# EAGLE design finalboard (EAGLE 9.6.2)
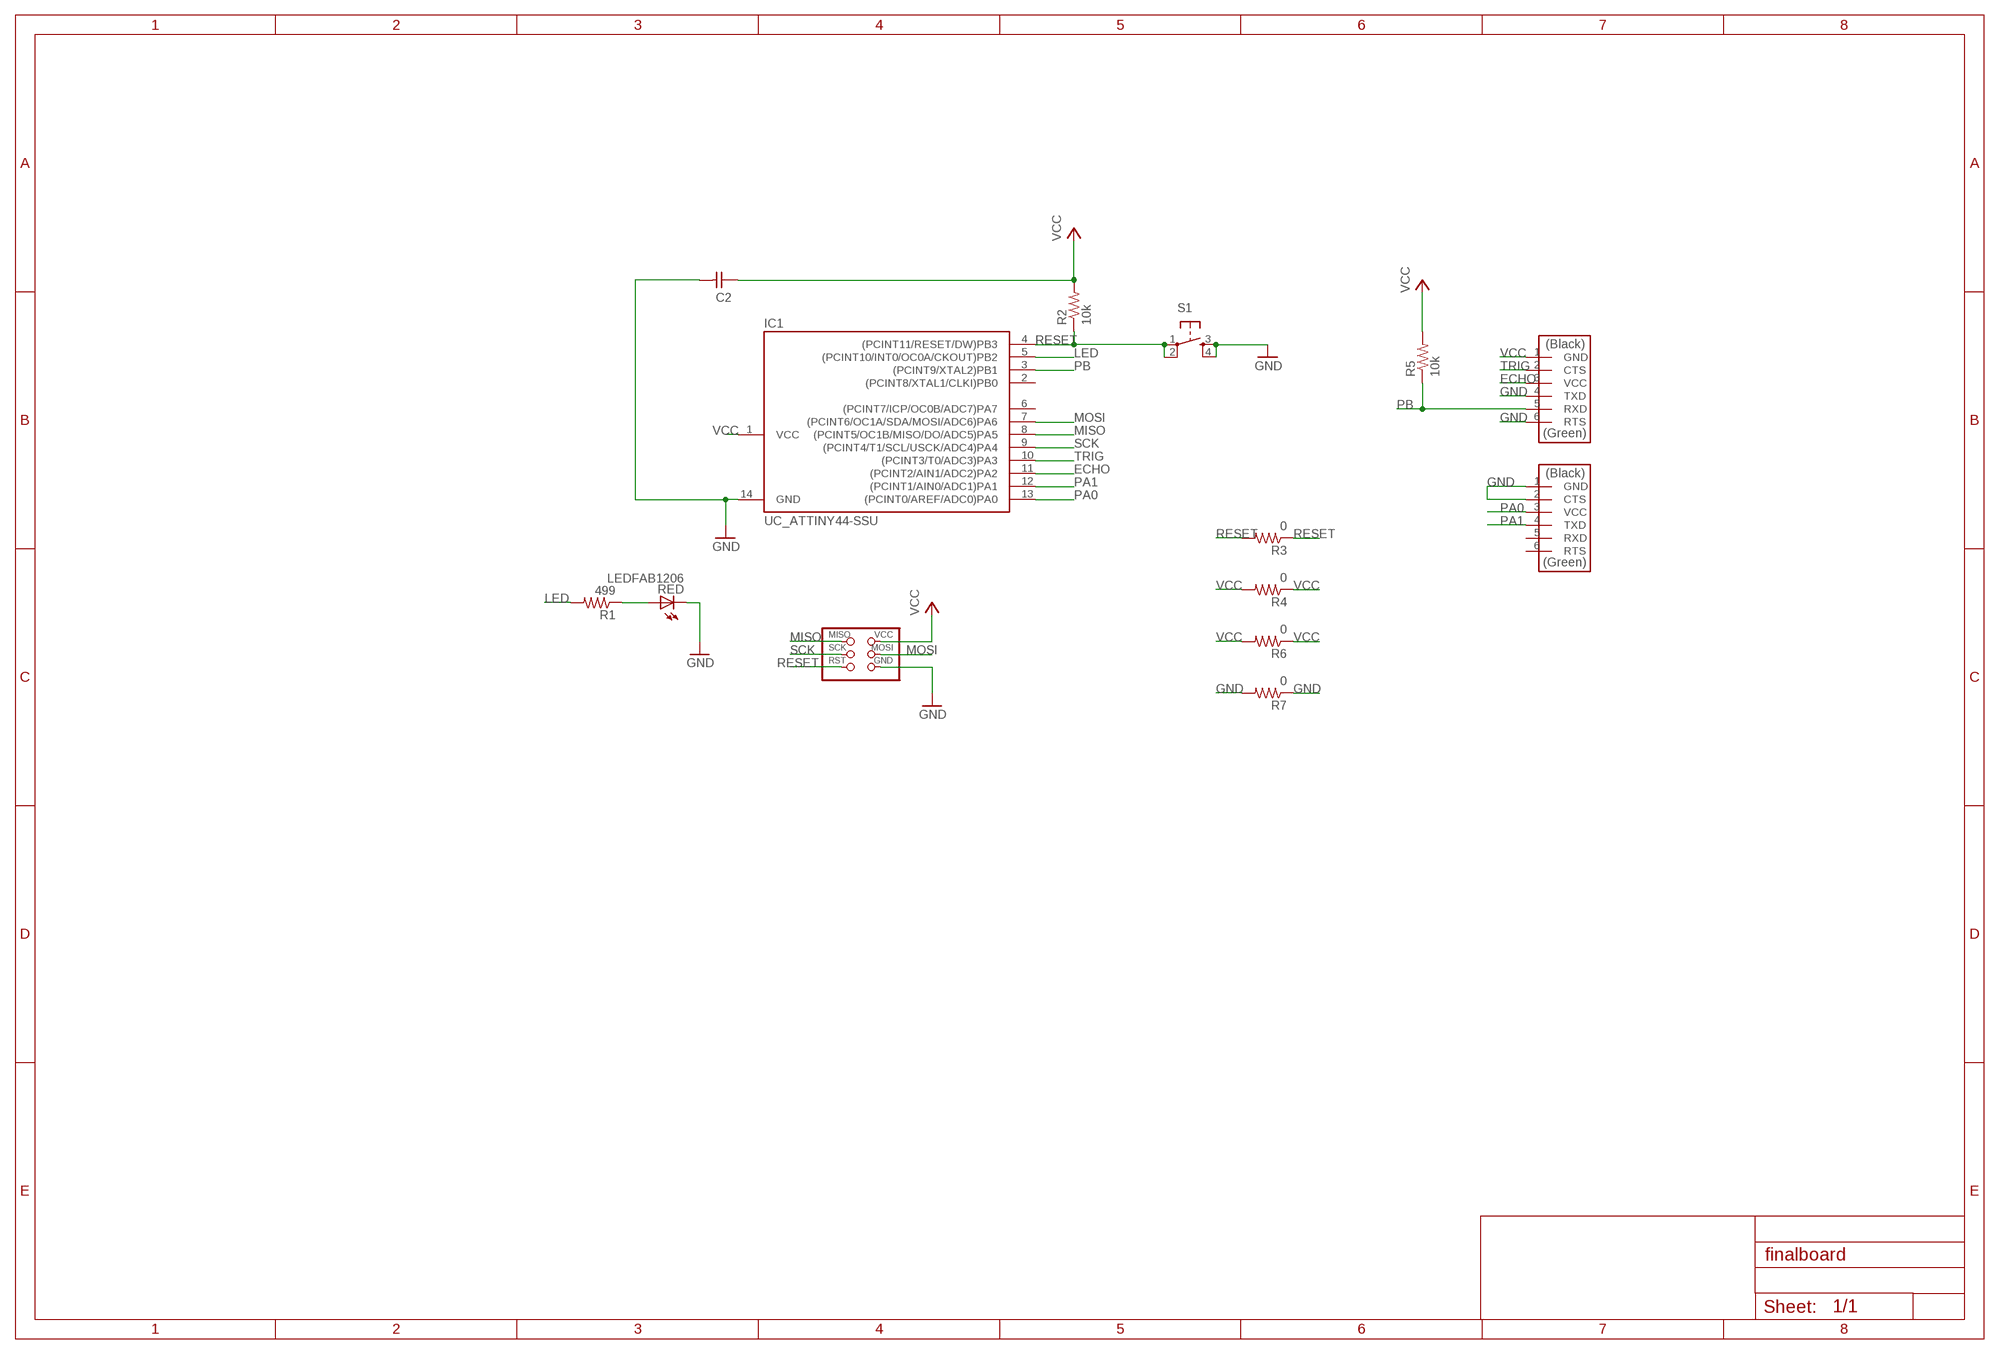
[diagram p0: schematic, sheet 1]

## Parts
C2  1u  CAP_UNPOLARIZEDFAB  [C1206FAB]
IC1  UC_ATTINY44-SSU  [SOIC14]
MOTOR  CONN_06_FTDI-SMD-HEADER  [1X06SMD]
R1  499  R1206FAB  [R1206FAB]
R2  10k  R1206FAB  [R1206FAB]
R3  0  R1206FAB  [R1206FAB]
R4  0  R1206FAB  [R1206FAB]
R5  10k  R1206FAB  [R1206FAB]
R6  0  R1206FAB  [R1206FAB]
R7  0  R1206FAB  [R1206FAB]
RED  LEDFAB1206  [LED1206FAB]
S1  SW_SWITCH_TACTILE_6MM6MM_SWITCH  [6MM_SWITCH]
U$3  CONN_03X2_AVRISPSMD  [2X03SMD]
ULTRANPB  CONN_06_FTDI-SMD-HEADER  [1X06SMD]

## Nets
ECHO: IC1.11((PCINT2/AIN1/ADC2)PA2) ULTRANPB.3(VCC)
GND: C2.2 IC1.14(GND) MOTOR.1(GND) MOTOR.2(CTS) R7.1 R7.2 RED.2(C) S1.3(S) S1.4(S1) U$3.6(GND) ULTRANPB.4(TXD) ULTRANPB.6(RTS)
LED: IC1.5((PCINT10/INT0/OC0A/CKOUT)PB2) R1.2
MISO: IC1.8((PCINT5/OC1B/MISO/DO/ADC5)PA5) U$3.1(MISO)
MOSI: IC1.7((PCINT6/OC1A/SDA/MOSI/ADC6)PA6) U$3.4(MOSI)
N$1: R1.1 RED.1(A)
PA0: IC1.13((PCINT0/AREF/ADC0)PA0) MOTOR.3(VCC)
PA1: IC1.12((PCINT1/AIN0/ADC1)PA1) MOTOR.4(TXD)
PB: IC1.3((PCINT9/XTAL2)PB1) R5.1 ULTRANPB.5(RXD)
RESET: IC1.4((PCINT11/RESET/DW)PB3) R2.1 R3.1 R3.2 S1.1(P) S1.2(P1) U$3.5(RST)
SCK: IC1.9((PCINT4/T1/SCL/USCK/ADC4)PA4) U$3.3(SCK)
TRIG: IC1.10((PCINT3/T0/ADC3)PA3) ULTRANPB.2(CTS)
VCC: C2.1 IC1.1(VCC) R2.2 R4.1 R4.2 R5.2 R6.1 R6.2 U$3.2(VCC) ULTRANPB.1(GND)
Unconnected: IC1.2((PCINT8/XTAL1/CLKI)PB0) IC1.6((PCINT7/ICP/OC0B/ADC7)PA7) MOTOR.5(RXD) MOTOR.6(RTS)

## Library data of the parts
C2 = eagle_fab:CAP_UNPOLARIZED
IC1 = eagle_fab:UC_ATTINY44
MOTOR ULTRANPB = eagle_fab:CONN_06_FTDI-SMD-HEADER
R1-R7 = eagle_fab:R: Resistor (US Symbol) Variants with postfix FAB are widened to allow the routing of internal traces
RED = eagle_fab:LED: LED
S1 = eagle_fab:SW_SWITCH_TACTILE_6MM: OMRON SWITCH
U$3 = eagle_fab:CONN_03X2_AVRISP

## Board
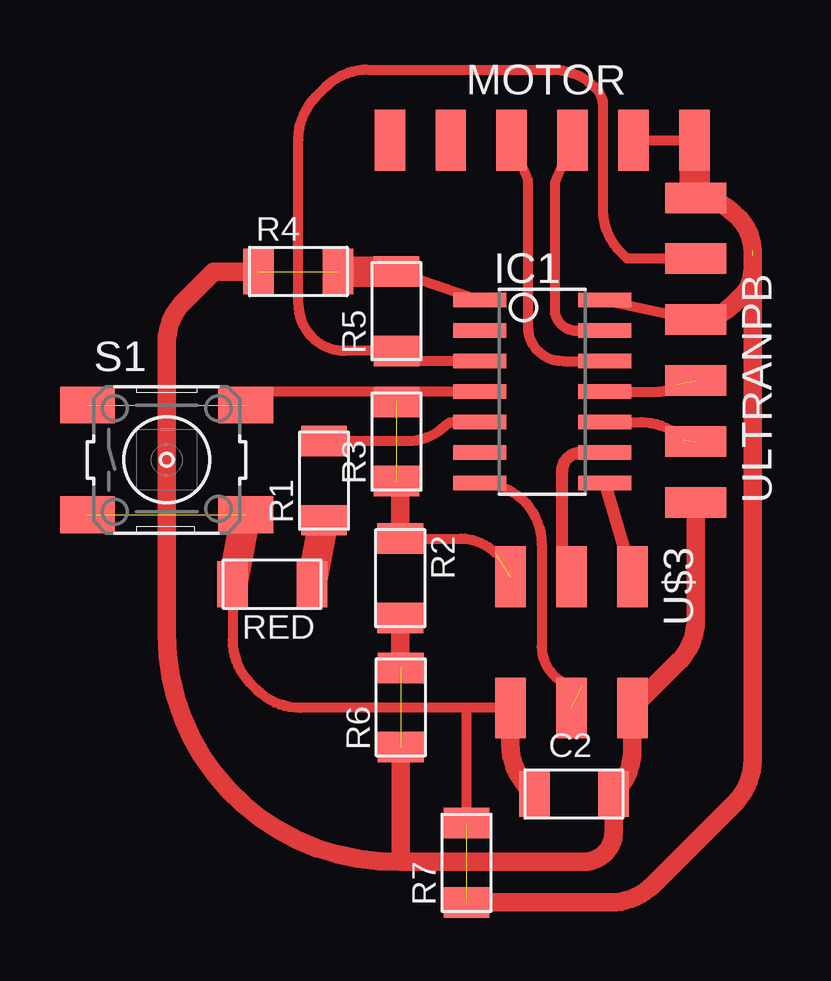
[diagram p1: board, top side]

No outline drawn. Coordinates in mm, seen from the top.
Copper layers (1*16): Top 0.035mm / dielectric 1.5mm / Bottom 0.035mm
Design rules "default *": minimum track width 16mil, minimum drill 0.35mm, track to track 16mil, track to pad 16mil, pad to pad 16mil, via to via 12mil, smd to smd 16mil, copper to edge 40mil, drill to drill 6mil, minimum pad ring 10mil, minimum via ring 8mil, stop-mask expansion 4mil, vias tented up to drill 0mil, thermal gap 10mil
Milling: 4 lines

### Footprints (pad centres in the part's own frame; a part is rotated, then mirrored left to right if it is on the bottom)
C1206FAB = smd 1.27 x 1.905: 1 -1.651,0; 2 1.651,0
SOIC14 = smd 0.61 x 2.21: 1 -3.81,-2.603; 2 -2.54,-2.603; 3 -1.27,-2.603; 4 0,-2.603; 5 1.27,-2.603; 6 2.54,-2.603; 7 3.81,-2.603; 8 3.81,2.603; 9 2.54,2.603; 10 1.27,2.603; 11 0,2.603; 12 -1.27,2.603; 13 -2.54,2.603; 14 -3.81,2.603
1X06SMD = smd 2.54 x 1.27: 1 0,6.35; 2 0,3.81; 3 0,1.27; 4 0,-1.27; 5 0,-3.81; 6 0,-6.35
R1206FAB = smd 1.27 x 1.905: 1 -1.651,0; 2 1.651,0
LED1206FAB = smd 1.27 x 1.905: 1 -1.651,0; 2 1.651,0
6MM_SWITCH = smd 2.286 x 1.524: 1 -3.302,2.286; 2 3.302,2.286; 3 -3.302,-2.286; 4 3.302,-2.286
2X03SMD = smd 2.54 x 1.27: 1 -2.54,2.54; 2 2.92,2.54; 3 -2.54,0; 4 2.92,0; 5 -2.54,-2.54; 6 2.92,-2.54

### Placement (x,y rotation side)
C2  26.21,8.33 180 top
IC1  24.89,25.1 270 top
MOTOR  24.89,35.56 270 top
R1  15.8,21.39 90 top
R2  18.97,17.32 270 top
R3  18.82,23.01 90 top
R4  14.73,30.1 0 top
R5  18.82,28.45 90 top
R6  19,11.94 90 top
R7  21.74,5.46 90 top
RED  13.64,17.07 180 top
S1  9.25,22.25 0 top
U$3  26.11,14.83 270 top
ULTRANPB  31.29,26.82 180 top

### Tracks (layer width: path | path; a pad name or v marks a point on that pad's centre or on a via)
ECHO  (1 unrouted)
  Top 0.406: IC1.11 29.77,25.09 arc45 30.5,25.4
GND  (3 unrouted)
  Top 0.406: MOTOR.2 MOTOR.1 | IC1.14 ULTRANPB.4 | U$3.6 21.77,11.91 | 21.77,11.91 14.82,11.91 arc-45 13.02,12.66 12.73,12.95 arc-45 11.99,14.74 RED.2 | R7.2 21.74,11.85 arc-45 21.77,11.91
  Top 0.762: U$3.6 23.57,10.37 arc45 24.32,8.58 C2.2 | ULTRANPB.6 arc-45 32.9,32.51 33.1,32.31 arc-45 33.66,30.96 | 33.66,30.18 33.66,30.76 | ULTRANPB.4 arc45 32.85,28.74 33.21,29.09 arc45 33.66,30.18 | 33.66,30.18 33.66,9.74 arc-45 32.91,7.94 29.52,4.55 arc-45 27.73,3.81 27.2,3.81 R7.1
  Top 1.27: MOTOR.1 31.24,33.3 arc45 ULTRANPB.6 | RED.2 S1.4
LED
  Top 0.406: R1.2 19.28,23.04 arc45 20.88,23.7 arc-45 21.18,23.82 IC1.5
MISO
  Top 0.508: IC1.8 U$3.1
MOSI  (1 unrouted)
  Top 0.406: IC1.7 22.33,21.29 arc-90 24.87,18.75 24.87,14.48 arc90 26.54,12.8
N$1
  Top 0.762: 15.56,17.34 RED.1
  Top 1.27: RED.1 R1.1
PA0
  Top 0.406: 26.16,34.65 MOTOR.3 25.43,33.78 25.43,28.4 arc90 26.49,27.64 IC1.13
PA1
  Top 0.406: 26.85,26.36 IC1.12 25.73,26.36 arc-90 24.31,27.79 24.31,33.9 MOTOR.4 23.62,34.77 23.5,34.92
PB
  Top 0.406: IC1.3 19.23,26.36 arc-90 R5.1 16.67,26.8 arc-90 14.73,28.74 14.73,35.6 arc-45 15.48,37.4 15.84,37.76 arc-45 17.64,38.51 25.31,38.51 arc-45 27.11,37.76 arc-45 27.43,36.98 27.43,32.69 arc45 28.18,30.89 28.43,30.63 ULTRANPB.5
RESET  (3 unrouted)
  Top 0.406: IC1.4 18.85,25.09 | 18.85,25.09 13.11,25.09 arc90 S1.2 | R2.1 21.5,18.97 arc-45 22.91,18.39 | R3.2 18.8,24.69 18.8,24.97 arc-45 18.85,25.09
  Top 0.762: R3.1 18.97,21.21 R2.1
SCK
  Top 0.508: U$3.3 arc-45 25.73,18.29 25.73,21.79 | IC1.9 26.49,22.55 arc90 25.73,21.79 | 25.73,21.79 25.73,21.94
TRIG  (1 unrouted)
  Top 0.406: IC1.10 29.01,23.82 arc-45 30.79,23.09
VCC  (2 unrouted)
  Top 0.406: R5.2 IC1.1
  Top 0.762: ULTRANPB.1 31.29,15.61 arc-45 30.55,13.81 U$3.2 28.65,10.17 arc-45 27.91,8.38 C2.1 27.86,6.73 arc-45 27.51,5.87 arc-45 26.65,5.51 19,5.51 | R4.1 11.2,30.1 9.99,28.89 arc45 9.25,27.09 9.25,14.99 arc92 19,5.51 | R2.2 18.97,13.65 arc45 R6.2 | R6.1 19,5.51
  Top 1.27: R4.2 R5.2